# Altium schematic sheet LED_board.SchDoc
size A; SheetNumber: 1; SheetTotal: 1
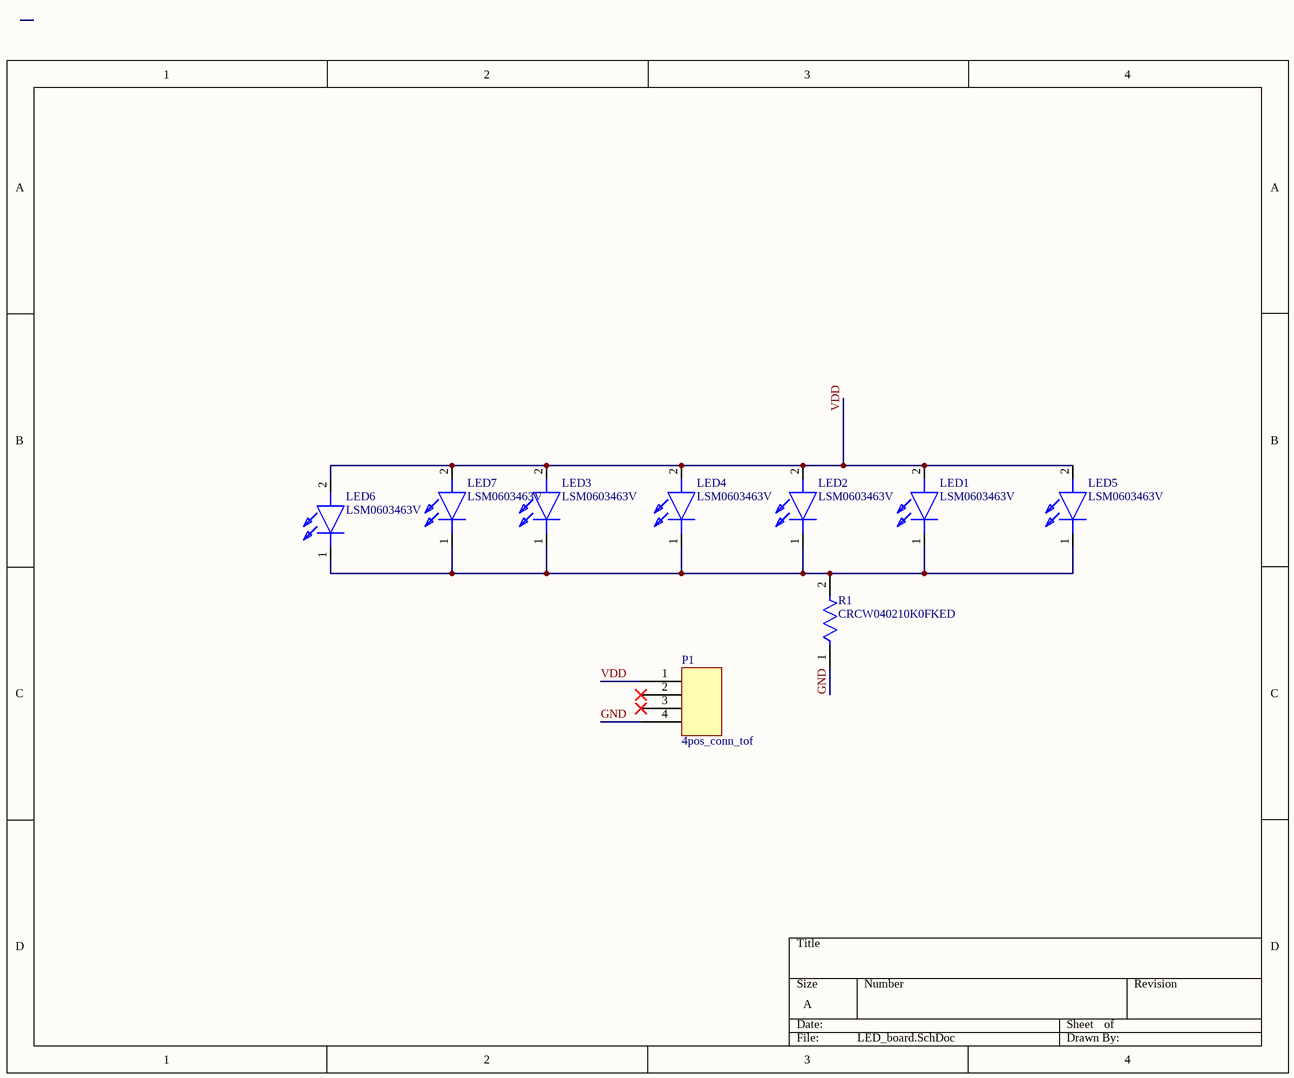
[diagram p0: LED_board.SchDoc]

## Parts
LED1  LSM0603463V  [LSM0603463V]
LED2  LSM0603463V  [LSM0603463V]
LED3  LSM0603463V  [LSM0603463V]
LED4  LSM0603463V  [LSM0603463V]
LED5  LSM0603463V  [LSM0603463V]
LED6  LSM0603463V  [LSM0603463V]
LED7  LSM0603463V  [LSM0603463V]
P1  4pos_conn_tof  [4pos_conn_tof]
R1  CRCW040210K0FKED  [FP-CRCW0402-e3-IPC_B]

## Nets
GND: P1.4 R1.1
VDD: LED1.2(A) LED2.2(A) LED3.2(A) LED4.2(A) LED5.2(A) LED6.2(A) LED7.2(A) P1.1
NetLED1_1: LED1.1(K) LED2.1(K) LED3.1(K) LED4.1(K) LED5.1(K) LED6.1(K) LED7.1(K) R1.2

Not connected (* = marked no-connect by the designer): P1 2* 3*

## Library data of the parts
LED1-LED7 = LSM0603463V: LED; Manufacturer_Name: Visual Communications Company; Datasheet Link: https://vcclite.com/wp-content/uploads/wpallimport/files/files/LSM0603463V.pdf; Height: 0.5mm; Manufacturer_Part_Number: LSM0603463V; Mouser Part Number: 593-LSM0603463V; Mouser Price/Stock: https://www.mouser.co.uk/ProductDetail/VCC/LSM0603463V?qs=%252BEew9%252B0nqrDuPtH0dpM5ug%3D%3D; Arrow Part Number: LSM0603463V; Arrow Price/Stock: https://www.arrow.com/en/products/lsm0603463v/visual-communications
R1 = CMP-2002-08135-2: RES SMD 10K OHM 1% 1/16W 0402; Power Rating: 63mW; Resistance: 10kR; Voltage Rating: 50V; Temperature Coefficient: 100ppm/°C; Case Code (Metric): 1005; Features: Automotive AEC-Q200; Termination: SMD/SMT; Mount: Surface Mount; Package Quantity: 10; Packaging: Tape and Reel; Case Code (Imperial): 0402; Weight: 2.3E-05oz; Lead Free: Lead Free; Width: 0.02inch; Max Power Dissipation: 63mW; Tolerance: 1%; Number of Terminations: 2; Height: 0.35mm; Number of Pins: 2; Composition: Thick Film; Length: 1mm; Voltage Rating (DC): 50V; Case/Package: 0402; Radiation Hardening: No; Contact Plating: Tin; Depth: 0.5mm; Military Standard: Not; Min Operating Temperature: -55°C; Max Operating Temperature: 155°C